# Altium schematic sheet BLDC测试V1.SchDoc
size A4
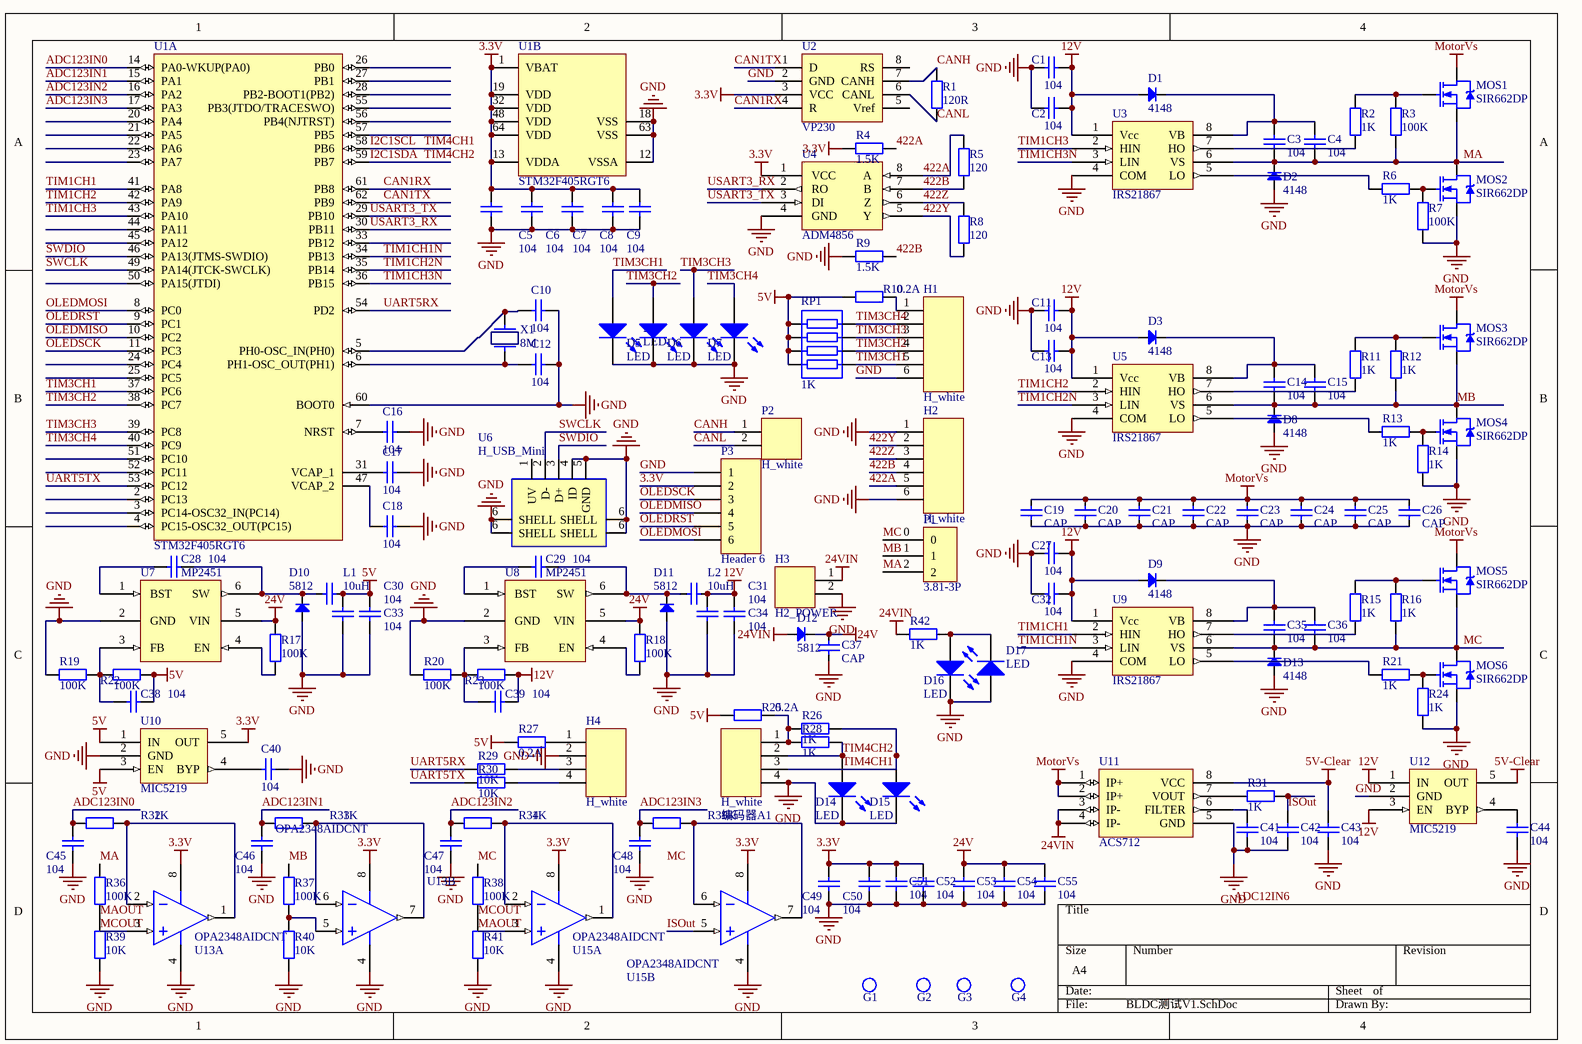
[diagram p0: BLDC测试V1.SchDoc]

## Parts
C1  104  [0805C]
C2  104  [0805C]
C3  104  [0805C]
C4  104  [0805C]
C5  104  [0805C]
C6  104  [0805C]
C7  104  [0805C]
C8  104  [0805C]
C9  104  [0805C]
C10  104  [0603C]
C11  104  [0805C]
C12  104  [0603C]
C13  104  [0805C]
C14  104  [0805C]
C15  104  [0805C]
C16  104  [0603C]
C17  104  [0805C]
C18  104  [0805C]
C19  CAP  [1210]
C20  CAP  [1210]
C21  CAP  [1210]
C22  CAP  [1210]
C23  CAP  [1210]
C24  CAP  [1210]
C25  CAP  [1210]
C26  CAP  [1210]
C27  104  [0805C]
C28  104  [0603C]
C29  104  [0603C]
C30  104  [0805C]
C31  104  [0805C]
C32  104  [0805C]
C33  104  [0805C]
C34  104  [0805C]
C35  104  [0805C]
C36  104  [0805C]
C37  CAP  [1210]
C38  104  [0603C]
C39  104  [0603C]
C40  104  [0805C]
C41  104  [0603C]
C42  104  [0603C]
C43  104  [0805C]
C44  104  [0603C]
C45  104  [0603C]
C46  104  [0603C]
C47  104  [0603C]
C48  104  [0603C]
C49  104  [0603C]
C50  104  [0603C]
C51  104  [0805C]
C52  104  [0805C]
C53  104  [0805C]
C54  104  [0805C]
C55  104  [0805C]
D1  4148  [1206D]
D2  4148  [1206D]
D3  4148  [1206D]
D4  LED  [0805P]
D5  LED  [0805P]
D6  LED  [0805P]
D7  LED  [0805P]
D8  4148  [1206D]
D9  4148  [1206D]
D10  5812  [1206D]
D11  5812  [1206D]
D12  5812  [1206D]
D13  4148  [1206D]
D14  LED  [0805P]
D15  LED  [0805P]
D16  LED  [0805P]
D17  LED  [0805P]
G1  M3过孔  [M3过孔]  (value not drawn)
G2  M3过孔  [M3过孔]  (value not drawn)
G3  M3过孔  [M3过孔]  (value not drawn)
G4  M3过孔  [M3过孔]  (value not drawn)
H1  H_white  [H6_white]
H2  H_white  [H6_white]
H3  H2_POWER  [H2_Power]
H4  H_white  [H4_white]
L1  10uH  [1210]
L2  10uH  [1210]
MOS1  SIR662DP  [POWERPACK-8]
MOS2  SIR662DP  [POWERPACK-8]
MOS3  SIR662DP  [POWERPACK-8]
MOS4  SIR662DP  [POWERPACK-8]
MOS5  SIR662DP  [POWERPACK-8]
MOS6  SIR662DP  [POWERPACK-8]
P1  3.81-3P  [校队的端子-3.81-3P]
P2  H_white  [H2_white]
P3  Header 6  [HDR1X6]
R1  120R  [0603]
R2  1K  [0603]
R3  100K  [0603]
R4  1.5K  [0603]
R5  120  [0603]
R6  1K  [0603]
R7  100K  [0603]
R8  120  [0603]
R9  1.5K  [0603]
R10  0.2A  [0603]
R11  1K  [0603]
R12  1K  [0603]
R13  1K  [0603]
R14  1K  [0603]
R15  1K  [0603]
R16  1K  [0603]
R17  100K  [0603]
R18  100K  [0603]
R19  100K  [0603]
R20  100K  [0603]
R21  1K  [0603]
R22  100K  [0603]
R23  100K  [0603]
R24  1K  [0603]
R25  0.2A  [0603]
R26  1K  [0805]
R27  0.2A  [0603]
R28  1K  [0805]
R29  10K  [0805]
R30  10K  [0805]
R31  1K  [0603]
R32  1K  [0603]
R33  1K  [0603]
R34  1K  [0603]
R35  1K  [0603]
R36  100K  [0603]
R37  100K  [0603]
R38  100K  [0603]
R39  10K  [0603]
R40  10K  [0603]
R41  10K  [0603]
R42  1K  [0805]
RP1  1K  [RESPACK 8P4R 0603]
U1  STM32F405RGT6  [STM-LQFP64_N]  (parts A,B of 2)
U2  VP230  [SOIC-8]
U3  IRS21867  [SOIC-NB-8]
U4  ADM4856  [SOIC-NB-8]
U5  IRS21867  [SOIC-NB-8]
U6  H_USB_Mini  [H_USB_Mini_A]
U7  MP2451  [SOT23-6]
U8  MP2451  [SOT23-6]
U9  IRS21867  [SOIC-NB-8]
U10  MIC5219  [SOT23-5]
U11  ACS712  [SOIC-NB-8]
U12  MIC5219  [SOT23-5]
U13  OPA2348AIDCNT  [TI-DCN8_N]  (parts A,B of 2)
U15  OPA2348AIDCNT  [TI-DCN8_N]  (parts A,B of 2)
X1  value 8M  [XTAL_DIP]  (hidden comment: xtal)
编码器A1  H_white  [H4_white]

## Nets
3.3V: C5.2 C6.1 C7.1 C8.1 C9.2 C49.1 C50.1 C51.2 C52.2 P3.2 R4.2 U1.1(VBAT) U1.13(VDDA) U1.19(VDD) U1.32(VDD) U1.48(VDD) U1.64(VDD) U2.3(VCC) U4.1(VCC) U10.5(OUT) U13.8(V+) U15.8(V+)
5V: C30.2 C33.2 C38.2 L1.2 R10.2 R22.1 R25.2 R27.2 RP1.1 RP1.3 RP1.5 RP1.7 U10.1(IN) U10.3(EN)
5V-Clear: C43.2 U11.8(VCC) U12.5(OUT)
12V: C1.1 C2.1 C11.1 C13.1 C27.1 C31.2 C32.1 C34.2 C39.2 D1.1(A) D3.1(A) D9.1(A) L2.2 R23.1 U3.1(Vcc) U5.1(Vcc) U9.1(Vcc) U12.1(IN) U12.3(EN)
24V: C37.1 C53.2 C54.2 C55.2 D12.2(K) R17.2 R18.2 U7.5(VIN) U8.5(VIN)
24VIN: D12.1(A) H3.1 R42.1 U11.3(IP-) U11.4(IP-)
GND: C1.2 C2.2 C5.1 C6.2 C7.2 C8.2 C9.1 C10.2 C11.2 C12.2 C13.2 C16.2 C17.2 C18.2 C19.2 C20.2 C21.2 C22.2 C23.2 C24.2 C25.2 C26.2 C27.2 C30.1 C31.1 C32.2 C33.1 C34.1 C37.2 C40.1 C41.2 C42.2 C43.1 C44.1 C45.2 C46.2 C47.2 C48.2 C49.2 C50.2 C51.1 C52.1 C53.1 C54.1 C55.1 D2.1(A) D4.2(K) D5.2(K) D6.2(K) D7.2(K) D8.1(A) D10.1(A) D11.1(A) D13.1(A) D14.2(K) D15.2(K) D16.2(K) D17.1(A) H1.6 H2.1 H2.6 H3.2 H4.2 MOS2.S MOS4.S MOS6.S P3.1 R7.1 R9.2 R14.1 R19.2 R20.2 R24.1 R39.2 R40.2 R41.2 U1.12(VSSA) U1.18(VSS) U1.60(BOOT0) U1.63(VSS) U2.2(GND) U3.4(COM) U4.4(GND) U5.4(COM) U6.4(ID) U6.5(GND) U6.6(SHELL) U7.2(GND) U8.2(GND) U9.4(COM) U10.2(GND) U11.5(GND) U12.2(GND) U13.4(V-) U15.4(V-) 编码器A1.4
MotorVs: C19.1 C20.1 C21.1 C22.1 C23.1 C24.1 C25.1 C26.1 MOS1.D MOS3.D MOS5.D U11.1(IP+) U11.2(IP+)
422A: H2.5 R4.1 R5.2 U4.8(A)
422B: H2.4 R5.1 R9.1 U4.7(B)
422Y: H2.2 R8.1 U4.5(Y)
422Z: H2.3 R8.2 U4.6(Z)
ADC123IN0: C45.1 R32.2 U1.14(PA0-WKUP(PA0))
ADC123IN1: C46.1 R33.2 U1.15(PA1)
ADC123IN2: C47.1 R34.2 U1.16(PA2)
ADC123IN3: C48.1 R35.2 U1.17(PA3)
CAN1RX: U1.61(PB8) U2.4(R)
CAN1TX: U1.62(PB9) U2.1(D)
CANH: P2.1 R1.1 U2.7(CANH)
CANL: P2.2 R1.2 U2.6(CANL)
I2C1SCL: D15.1(A) R26.2 U1.58(PB6) 编码器A1.3  [also labelled TIM4CH1]
I2C1SDA: D14.1(A) R28.2 U1.59(PB7) 编码器A1.2  [also labelled TIM4CH2]
ISOut: C42.1 R31.2 U15.5(IN_B+)
MA: C3.1 C4.1 D2.2(K) MOS1.S MOS2.D P1.2 R3.2 R36.1 U3.6(VS)
MAOUT: R36.2 R39.1 U15.3(IN_A+)
MB: C14.1 C15.1 D8.2(K) MOS3.S MOS4.D P1.1 R12.2 R37.1 U5.6(VS)
MC: C35.1 C36.1 D13.2(K) MOS5.S MOS6.D P1.0 R16.2 R38.1 U9.6(VS)
MCOUT: R38.2 R41.1 U13.3(IN_A+)
OLEDMISO: P3.4 U1.10(PC2)
OLEDMOSI: P3.6 U1.8(PC0)
OLEDRST: P3.5 U1.9(PC1)
OLEDSCK: P3.3 U1.11(PC3)
SWCLK: U1.49(PA14(JTCK-SWCLK)) U6.2(D-)
SWDIO: U1.46(PA13(JTMS-SWDIO)) U6.3(D+)
TIM1CH1: U1.41(PA8) U9.2(HIN)
TIM1CH1N: U1.34(PB13) U9.3(LIN)
TIM1CH2: U1.42(PA9) U5.2(HIN)
TIM1CH2N: U1.35(PB14) U5.3(LIN)
TIM1CH3: U1.43(PA10) U3.2(HIN)
TIM1CH3N: U1.36(PB15) U3.3(LIN)
TIM3CH1: D4.1(A) H1.5 RP1.8 U1.37(PC6)
TIM3CH2: D5.1(A) H1.4 RP1.6 U1.38(PC7)
TIM3CH3: D6.1(A) H1.3 RP1.4 U1.39(PC8)
TIM3CH4: D7.1(A) H1.2 RP1.2 U1.40(PC9)
UART5RX: R29.2 U1.54(PD2)
UART5TX: R30.2 U1.53(PC12)
USART3_RX: U1.30(PB11) U4.2(RO)
USART3_TX: U1.29(PB10) U4.3(DI)
NetC3_2: C3.2 C4.2 D1.2(K) U3.8(VB)
NetC10_1: C10.1 U1.5(PH0-OSC_IN(PH0)) X1.2
NetC12_1: C12.1 U1.6(PH1-OSC_OUT(PH1)) X1.1
NetC14_2: C14.2 C15.2 D3.2(K) U5.8(VB)
NetC16_1: C16.1 U1.7(NRST)
NetC17_1: C17.1 U1.31(VCAP_1)
NetC18_1: C18.1 U1.47(VCAP_2)
NetC28_1: C28.1 U7.1(BST)
NetC28_2: C28.2 D10.2(K) L1.1 U7.6(SW)
NetC29_1: C29.1 U8.1(BST)
NetC29_2: C29.2 D11.2(K) L2.1 U8.6(SW)
NetC35_2: C35.2 C36.2 D9.2(K) U9.8(VB)
NetC38_1: C38.1 R19.1 R22.2 U7.3(FB)
NetC39_1: C39.1 R20.1 R23.2 U8.3(FB)
NetC40_2: C40.2 U10.4(BYP)
NetC41_1: C41.1 U11.6(FILTER)
NetC44_2: C44.2 U12.4(BYP)
NetD16_1: D16.1(A) D17.2(K) R42.2
NetH1_1: H1.1 R10.1
NetH4_1: H4.1 R27.1
NetH4_3: H4.3 R29.1
NetH4_4: H4.4 R30.1
NetMOS1_G: MOS1.G R2.2 R3.1
NetMOS2_G: MOS2.G R6.2 R7.2
NetMOS3_G: MOS3.G R11.2 R12.1
NetMOS4_G: MOS4.G R13.2 R14.2
NetMOS5_G: MOS5.G R15.2 R16.1
NetMOS6_G: MOS6.G R21.2 R24.2
NetR2_1: R2.1 U3.7(HO)
NetR6_1: R6.1 U3.5(LO)
NetR11_1: R11.1 U5.7(HO)
NetR13_1: R13.1 U5.5(LO)
NetR15_1: R15.1 U9.7(HO)
NetR17_1: R17.1 U7.4(EN)
NetR18_1: R18.1 U8.4(EN)
NetR21_1: R21.1 U9.5(LO)
NetR25_1: R25.1 R26.1 R28.1 编码器A1.1
NetR31_1: R31.1 U11.7(VOUT)
NetR32_1: R32.1 U13.1(OUT_A) U13.2(IN_A-)
NetR33_1: R33.1 U13.6(IN_B-) U13.7(OUT_B)
NetR34_1: R34.1 U15.1(OUT_A) U15.2(IN_A-)
NetR35_1: R35.1 U15.6(IN_B-) U15.7(OUT_B)
NetR37_2: R37.2 R40.1 U13.5(IN_B+)

Not connected (* = marked no-connect by the designer): U1 2(PC13) 3(PC14-OSC32_IN(PC14)) 4(PC15-OSC32_OUT(PC15)) 20(PA4) 21(PA5) 22(PA6) 23(PA7) 24(PC4) 25(PC5) 26(PB0) 27(PB1) 28(PB2-BOOT1(PB2)) 33(PB12) 44(PA11) 45(PA12) 50(PA15(JTDI)) 51(PC10) 52(PC11) 55(PB3(JTDO/TRACESWO)) 56(PB4(NJTRST)) 57(PB5); U2 5(Vref) 8(RS); U6 1(UV)

## Notes on the sheet
- Labels drawn without touching a wire or pin: ADC12IN6, MC

## Library data of the parts
C1-C18 C27-C36 C38-C55 = cap: value: 10uF
D1-D3 D8-D13 = diode 4148
H1 H2 = header6 white
H4 编码器A1 = header4 white
L1 L2 = CAP
P1 = 校队端子-3.81-3P
P2 = header2 white
P3 = Header 6: Header, 6-Pin; LatestRevisionDate: 17-Jul-2002; LatestRevisionNote: Re-released for DXP Platform.; Publisher: Altium Limited
R1 R3-R5 R7-R10 R17-R20 R22 R23 R25 R27 R29 R30 R36-R41 = resistor: small resistor; value: 1K
R2 R6 R11-R16 R21 R24 R26 R28 R31-R35 R42 = resistor: small resistor; value: 1K
RP1 = RESPACK4 8P4R
U1 = STM32F405RGT6: ARM Cortex-M4 32-bit MCU+FPU, 210 DMIPS, 1024 kB Flash, 192 kB Internal RAM, 51 I/Os, 64-pin LQFP, -40 to 85 degC, Tray; Manufacturer: STMicroelectronics; D/A Converter: 2x12-bit; FLASH Size (Prog) (kB): 1024; I/Os (High Current): 51; Internal RAM Size (kB): 192; Operating Frequency(F) (Processor speed) (MHz): 168; Supply Voltage(Vcc) max (V): 3.6; Supply Voltage(Vcc) min (V): 1.8; DatasheetVersion: Rev. 4; PackageVersion: Rev. 4, 06/2013; PackageReference: LQFP64; PackageDescription: 64-Pin Low Profile Quad Flat Package, 10 x 10 mm Body, 0.5 mm Pitch; Supplier 1: Digi-Key; Supplier Part Number 1: 497-11767-ND; Supplier 2: Farnell; Supplier Part Number 2: 2064363; Supplier 3: Newark; Supplier Part Number 3: 73T2329; Supplier 4: Mouser; Supplier Part Number 4: 511-STM32F405RGT6; Core: ARM Cortex-M4; Packing: Tray; Mounting Technology: Surface Mount; PartNumber: STM32F405RGT6; ComponentLink1Description: Manufacturer URL; ComponentLink1URL: http://www.st.com/web/en/home.html; ComponentLink2Description: Datasheet; ComponentLink2URL: http://www.st.com/st-web-ui/static/active/en/resource/technical/document/datasheet/DM00037051.pdf; ComponentLink3Description: Package Specification; ComponentLink3URL: http://www.st.com/st-web-ui/static/active/en/resource/technical/document/datasheet/DM00037051.pdf
U6 = H_USB_Mini: MiniUSB头母头
U13 U15 = OPA2348AIDCNT: 1 MHz, 45 uA, RRIO, Dual Operational Amplifier, 2.1 to 5.5 V, -40 to 125 degC, 8-pin SOP (DCN8), Green (RoHS & no Sb/Br); Manufacturer: Texas Instruments; CMRR(Min)(dB): 70; GBW(Typ)(MHz): 1; IIB(Max)(pA): 10; Iq per channel(Max)(mA): 0.065; Number of Channels: 2; Offset Drift(Typ)(uV/C): 4; Packing: SMALL T&R; Rating: Catalog; Slew Rate(Typ)(V/us): 0.5; Sub Family: Low Input Bias Current Amp (<=10pA), Low Power Amp (<=500uA), Low Supply Voltage Amplifier (<=2.7V), Precision Amplifier; Total Supply Voltage(Max)(+5V is 5, +/-5V is 10): 5.5; Total Supply Voltage(Min)(+5V is 5, +/-5V is 10): 2.1; Vio (25C)(Max)(mV): 5; DatasheetVersion: SBOS213G; PackageVersion: 4202106/D, 11/2009; PackageReference: DCN8; PackageDescription: 8-Pin Plastic Small Outline, Body 1.6 x 2.9 mm, Pitch 0.65 mm; Supplier 1: Digi-Key; Supplier Part Number 1: 296-13008-2-ND; Supplier 2: Digi-Key; Supplier Part Number 2: 296-13008-1-ND; Supplier 3: Digi-Key; Supplier Part Number 3: 296-13008-6-ND; Supplier 4: Newark; Supplier Part Number 4: 75C4724; Supplier 5: Mouser; Supplier Part Number 5: 595-OPA2348AIDCNT; Eco-Plan: Green (RoHS & no Sb/Br); Mounting Technology: Surface Mount; Code_JEDEC: MO-178; PartNumber: OPA2348AIDCNT; ComponentLink1Description: Manufacturer URL; ComponentLink1URL: http://www.ti.com/; ComponentLink2Description: Datasheet; ComponentLink2URL: http://www.ti.com/lit/ds/symlink/opa2348.pdf; ComponentLink3Description: Package Specification; ComponentLink3URL: http://www.ti.com/lit/ml/mpds099c/mpds099c.pdf